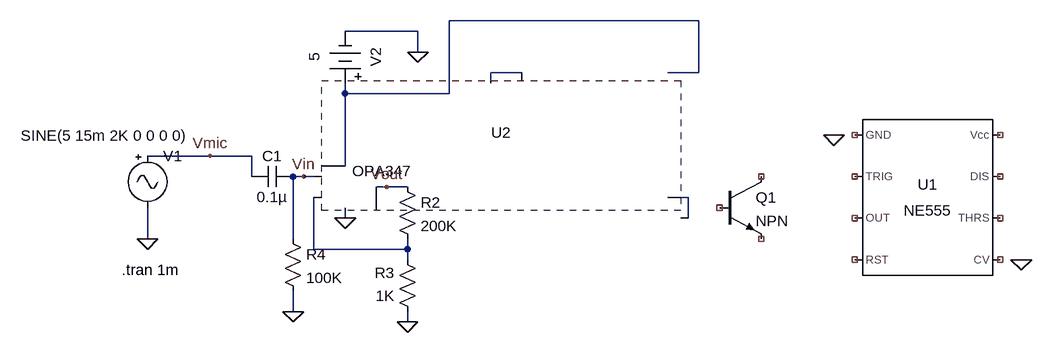
[diagram p0: schematic doubleClapSim.asc]
doubleClapSim.asc, the LTspice schematic file:
Version 4
SHEET 1 1300 680
WIRE 784 -48 400 -48
WIRE 352 -32 240 -32
WIRE 352 0 352 -32
WIRE 512 32 464 32
WIRE 784 32 784 -48
WIRE 784 32 736 32
WIRE 464 48 464 32
WIRE 240 64 240 48
WIRE 400 64 400 -48
WIRE 400 64 240 64
WIRE 32 160 -64 160
WIRE 96 160 32 160
WIRE 240 176 240 64
WIRE 96 192 96 160
WIRE 176 192 160 192
WIRE 192 192 176 192
WIRE 304 208 288 208
WIRE 336 208 304 208
WIRE 768 224 736 224
WIRE 240 256 240 240
WIRE 768 256 768 224
WIRE -64 288 -64 240
WIRE 160 288 160 192
WIRE 192 304 192 224
WIRE 336 304 336 288
WIRE 336 304 192 304
WIRE 336 320 336 304
WIRE 160 400 160 368
WIRE 336 416 336 400
FLAG -64 288 0
FLAG 160 400 0
FLAG 176 192 Vin
FLAG 336 416 0
FLAG 240 256 0
FLAG 32 160 Vmic
FLAG 304 208 Vout
FLAG 352 0 0
FLAG 1280 320 0
FLAG 992 128 0
SYMBOL Misc\\signal -64 144 R0
WINDOW 123 0 0 Left 0
WINDOW 39 0 0 Left 0
WINDOW 3 -195 -15 Left 2
SYMATTR InstName V1
SYMATTR Value SINE(5 15m 2K 0 0 0 0)
SYMBOL Misc\\battery 240 64 R180
WINDOW 0 -32 56 VBottom 2
WINDOW 3 32 56 VTop 2
WINDOW 123 0 0 Left 0
WINDOW 39 0 0 Left 0
SYMATTR InstName V2
SYMATTR Value 5
SYMBOL cap 160 176 R90
WINDOW 0 0 32 VBottom 2
WINDOW 3 32 32 VTop 2
SYMATTR InstName C1
SYMATTR Value 0.1µ
SYMATTR SpiceLine V=10V
SYMBOL res 352 416 R180
WINDOW 0 36 76 Left 2
WINDOW 3 36 40 Left 2
SYMATTR InstName R3
SYMATTR Value 1K
SYMBOL res 144 272 R0
SYMATTR InstName R4
SYMATTR Value 100K
SYMBOL res 320 192 R0
SYMATTR InstName R2
SYMATTR Value 200K
SYMBOL AutoGenerated\\OPA347 224 208 R0
WINDOW 3 72 -40 Top 2
SYMATTR InstName U2
SYMBOL npn 816 192 R0
SYMATTR InstName Q1
SYMBOL Misc\\NE555 1136 224 R0
SYMATTR InstName U1
TEXT -104 336 Left 2 !.tran 1m

The netlist it stands for:
* doubleClapSim.asc
V1 Vmic 0 SINE(5 15m 2K 0 0 0 0)
V2 N001 0 5
C1 Vin Vmic 0.1µ V=10V
R3 0 N004 1K
R4 Vin 0 100K
R2 Vout N004 200K
* U2: OPA347 (symbol AutoGenerated\OPA347 not available, pin order unknown); nets seen at it: 0, N001, N002, N003, N004, Vin, Vout
Q1 NC_01 NC_02 NC_03 0 NPN
XU1 NC_04 NC_05 NC_06 NC_07 NC_08 NC_09 NC_10 NC_11 NE555  ; pins GND TRIG OUT RST CV THRS DIS Vcc
.model NPN NPN
.model PNP PNP
.lib standard.bjt
.tran 1m
.lib NE555.sub
.backanno
.end